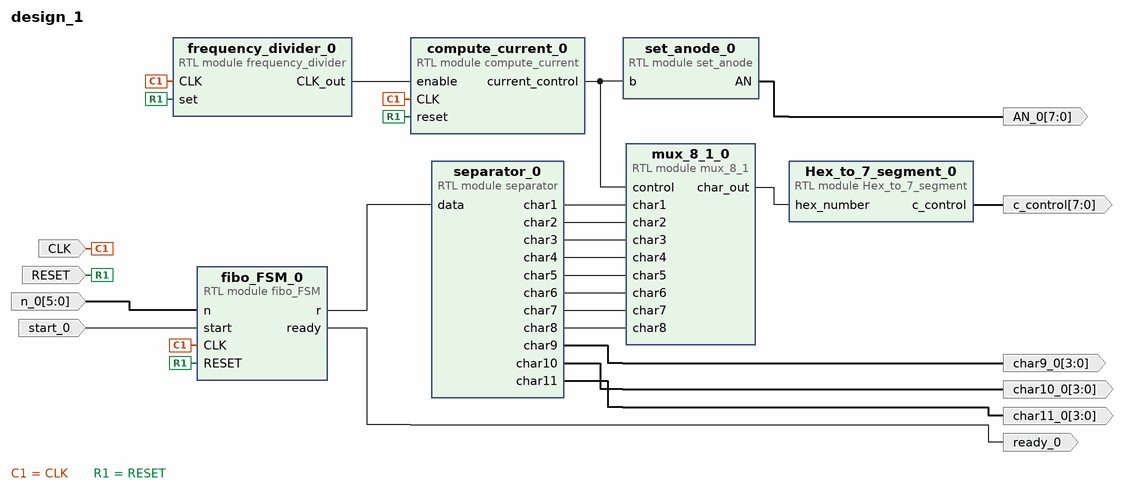
[diagram p0: block diagram of the top level]
# Vivado block design design_1, xc7a100tcsg324-1, Vivado 2021.2
create_bd_design design_1

create_bd_port -dir I -type clk CLK
create_bd_port -dir I RESET
create_bd_port -dir O -from 7 -to 0 AN_0
create_bd_port -dir O -from 7 -to 0 c_control
create_bd_port -dir I start_0
create_bd_port -dir I -from 5 -to 0 n_0
create_bd_port -dir O ready_0
create_bd_port -dir O -from 3 -to 0 char9_0
create_bd_port -dir O -from 3 -to 0 char10_0
create_bd_port -dir O -from 3 -to 0 char11_0

create_bd_cell -type module -reference set_anode set_anode_0
create_bd_cell -type module -reference frequency_divider frequency_divider_0
create_bd_cell -type module -reference compute_current compute_current_0
create_bd_cell -type module -reference mux_8_1 mux_8_1_0
create_bd_cell -type module -reference Hex_to_7_segment Hex_to_7_segment_0
create_bd_cell -type module -reference separator separator_0
create_bd_cell -type module -reference fibo_FSM fibo_FSM_0

# ---- connections ----

connect_bd_net [get_bd_ports CLK] [get_bd_pins frequency_divider_0/CLK] [get_bd_pins compute_current_0/CLK] [get_bd_pins fibo_FSM_0/CLK]
connect_bd_net [get_bd_pins Hex_to_7_segment_0/c_control] [get_bd_ports c_control]
connect_bd_net [get_bd_pins compute_current_0/current_control] [get_bd_pins set_anode_0/b] [get_bd_pins mux_8_1_0/control]
connect_bd_net [get_bd_pins fibo_FSM_0/r] [get_bd_pins separator_0/data]
connect_bd_net [get_bd_pins fibo_FSM_0/ready] [get_bd_ports ready_0]
connect_bd_net [get_bd_pins frequency_divider_0/CLK_out] [get_bd_pins compute_current_0/enable]
connect_bd_net [get_bd_pins mux_8_1_0/char_out] [get_bd_pins Hex_to_7_segment_0/hex_number]
connect_bd_net -net n_0_1 [get_bd_ports n_0] [get_bd_pins fibo_FSM_0/n]
connect_bd_net [get_bd_pins separator_0/char1] [get_bd_pins mux_8_1_0/char1]
connect_bd_net [get_bd_pins separator_0/char2] [get_bd_pins mux_8_1_0/char2]
connect_bd_net [get_bd_pins separator_0/char3] [get_bd_pins mux_8_1_0/char3]
connect_bd_net [get_bd_pins separator_0/char4] [get_bd_pins mux_8_1_0/char4]
connect_bd_net [get_bd_pins separator_0/char5] [get_bd_pins mux_8_1_0/char5]
connect_bd_net [get_bd_pins separator_0/char6] [get_bd_pins mux_8_1_0/char6]
connect_bd_net [get_bd_pins separator_0/char7] [get_bd_pins mux_8_1_0/char7]
connect_bd_net [get_bd_pins separator_0/char8] [get_bd_pins mux_8_1_0/char8]
connect_bd_net [get_bd_pins separator_0/char9] [get_bd_ports char9_0]
connect_bd_net [get_bd_pins separator_0/char10] [get_bd_ports char10_0]
connect_bd_net [get_bd_pins separator_0/char11] [get_bd_ports char11_0]
connect_bd_net -net set_0_1 [get_bd_ports RESET] \
  [get_bd_pins frequency_divider_0/set] [get_bd_pins compute_current_0/reset] [get_bd_pins fibo_FSM_0/RESET]
connect_bd_net [get_bd_pins set_anode_0/AN] [get_bd_ports AN_0]
connect_bd_net -net start_0_1 [get_bd_ports start_0] [get_bd_pins fibo_FSM_0/start]

validate_bd_design
save_bd_design
